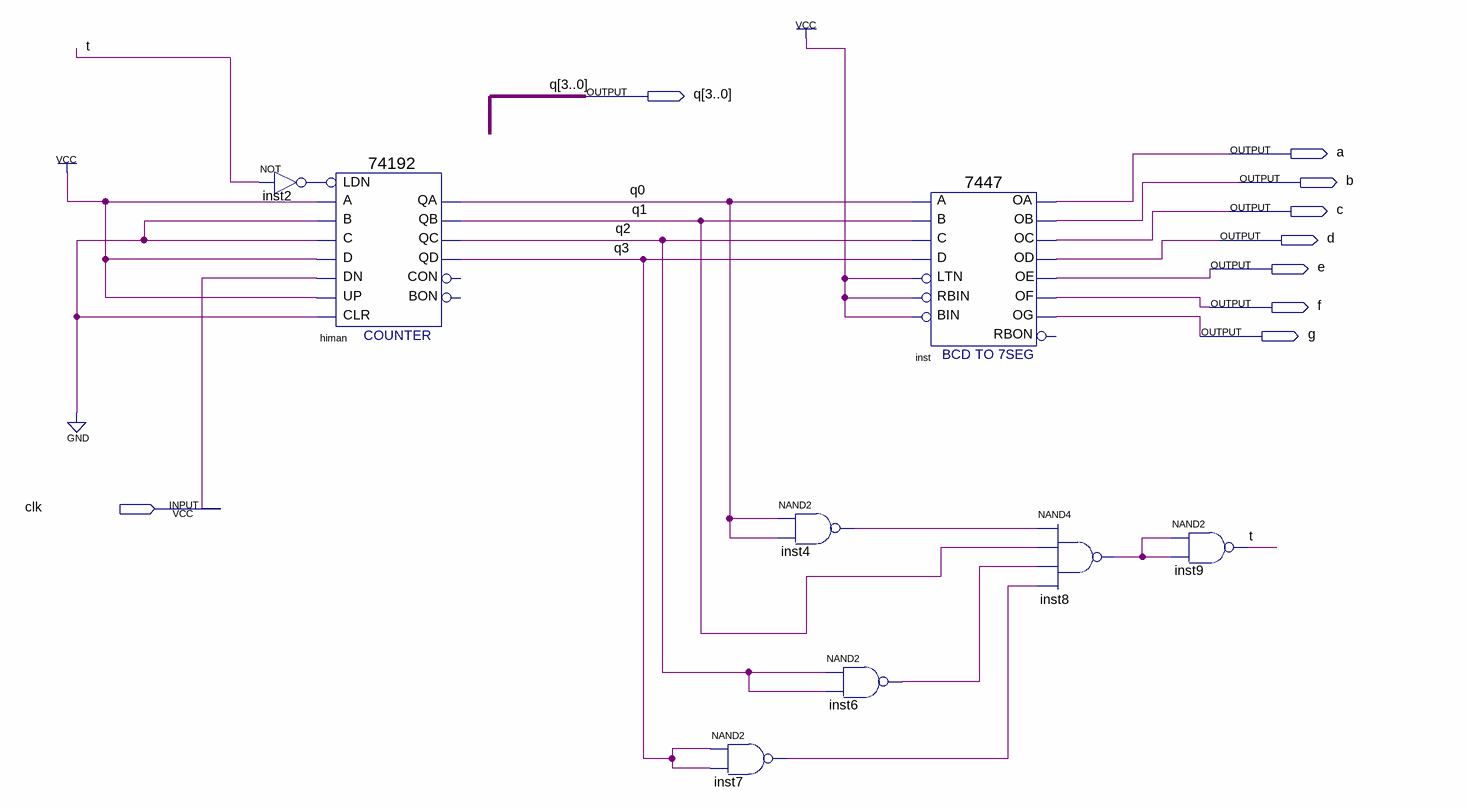
[diagram p0: schematic sheet]
// Quartus schematic firstweekprelab.bdf as structural Verilog: 8 symbols, 9 pins
module firstweekprelab (
  input  clk,
  output [3:0] q,
  output a,
  output b,
  output c,
  output d,
  output e,
  output f,
  output g
);

  wire inst2_out, inst4_out, inst6_out, inst7_out, inst8_out, t;

  not inst2 (inst2_out, t);
  \74192  himan (
    .D(1'b1), .C(1'b0), .A(1'b1), .B(1'b0), .CLR(1'b0), .UP(1'b1), .DN(clk), .LDN(inst2_out), .QB(q[1]),
    .QA(q[0]), .QC(q[2]), .QD(q[3]));  // open: BON, CON
  nand inst7 (inst7_out, q[3], q[3]);
  nand inst4 (inst4_out, q[0], q[0]);
  nand inst6 (inst6_out, q[2], q[2]);
  \7447  inst (
    .LTN(1'b1), .B(q[1]), .C(q[2]), .D(q[3]), .RBIN(1'b1), .BIN(1'b1), .A(q[0]), .OB(b), .OC(c), .OE(e),
    .OD(d), .OF(f), .OG(g), .OA(a));  // open: RBON
  nand inst8 (inst8_out, inst4_out, q[1], inst6_out, inst7_out);
  nand inst9 (t, inst8_out, inst8_out);
endmodule
